# EAGLE board mmu6100 (EAGLE 6.6.0), part 1 of 2
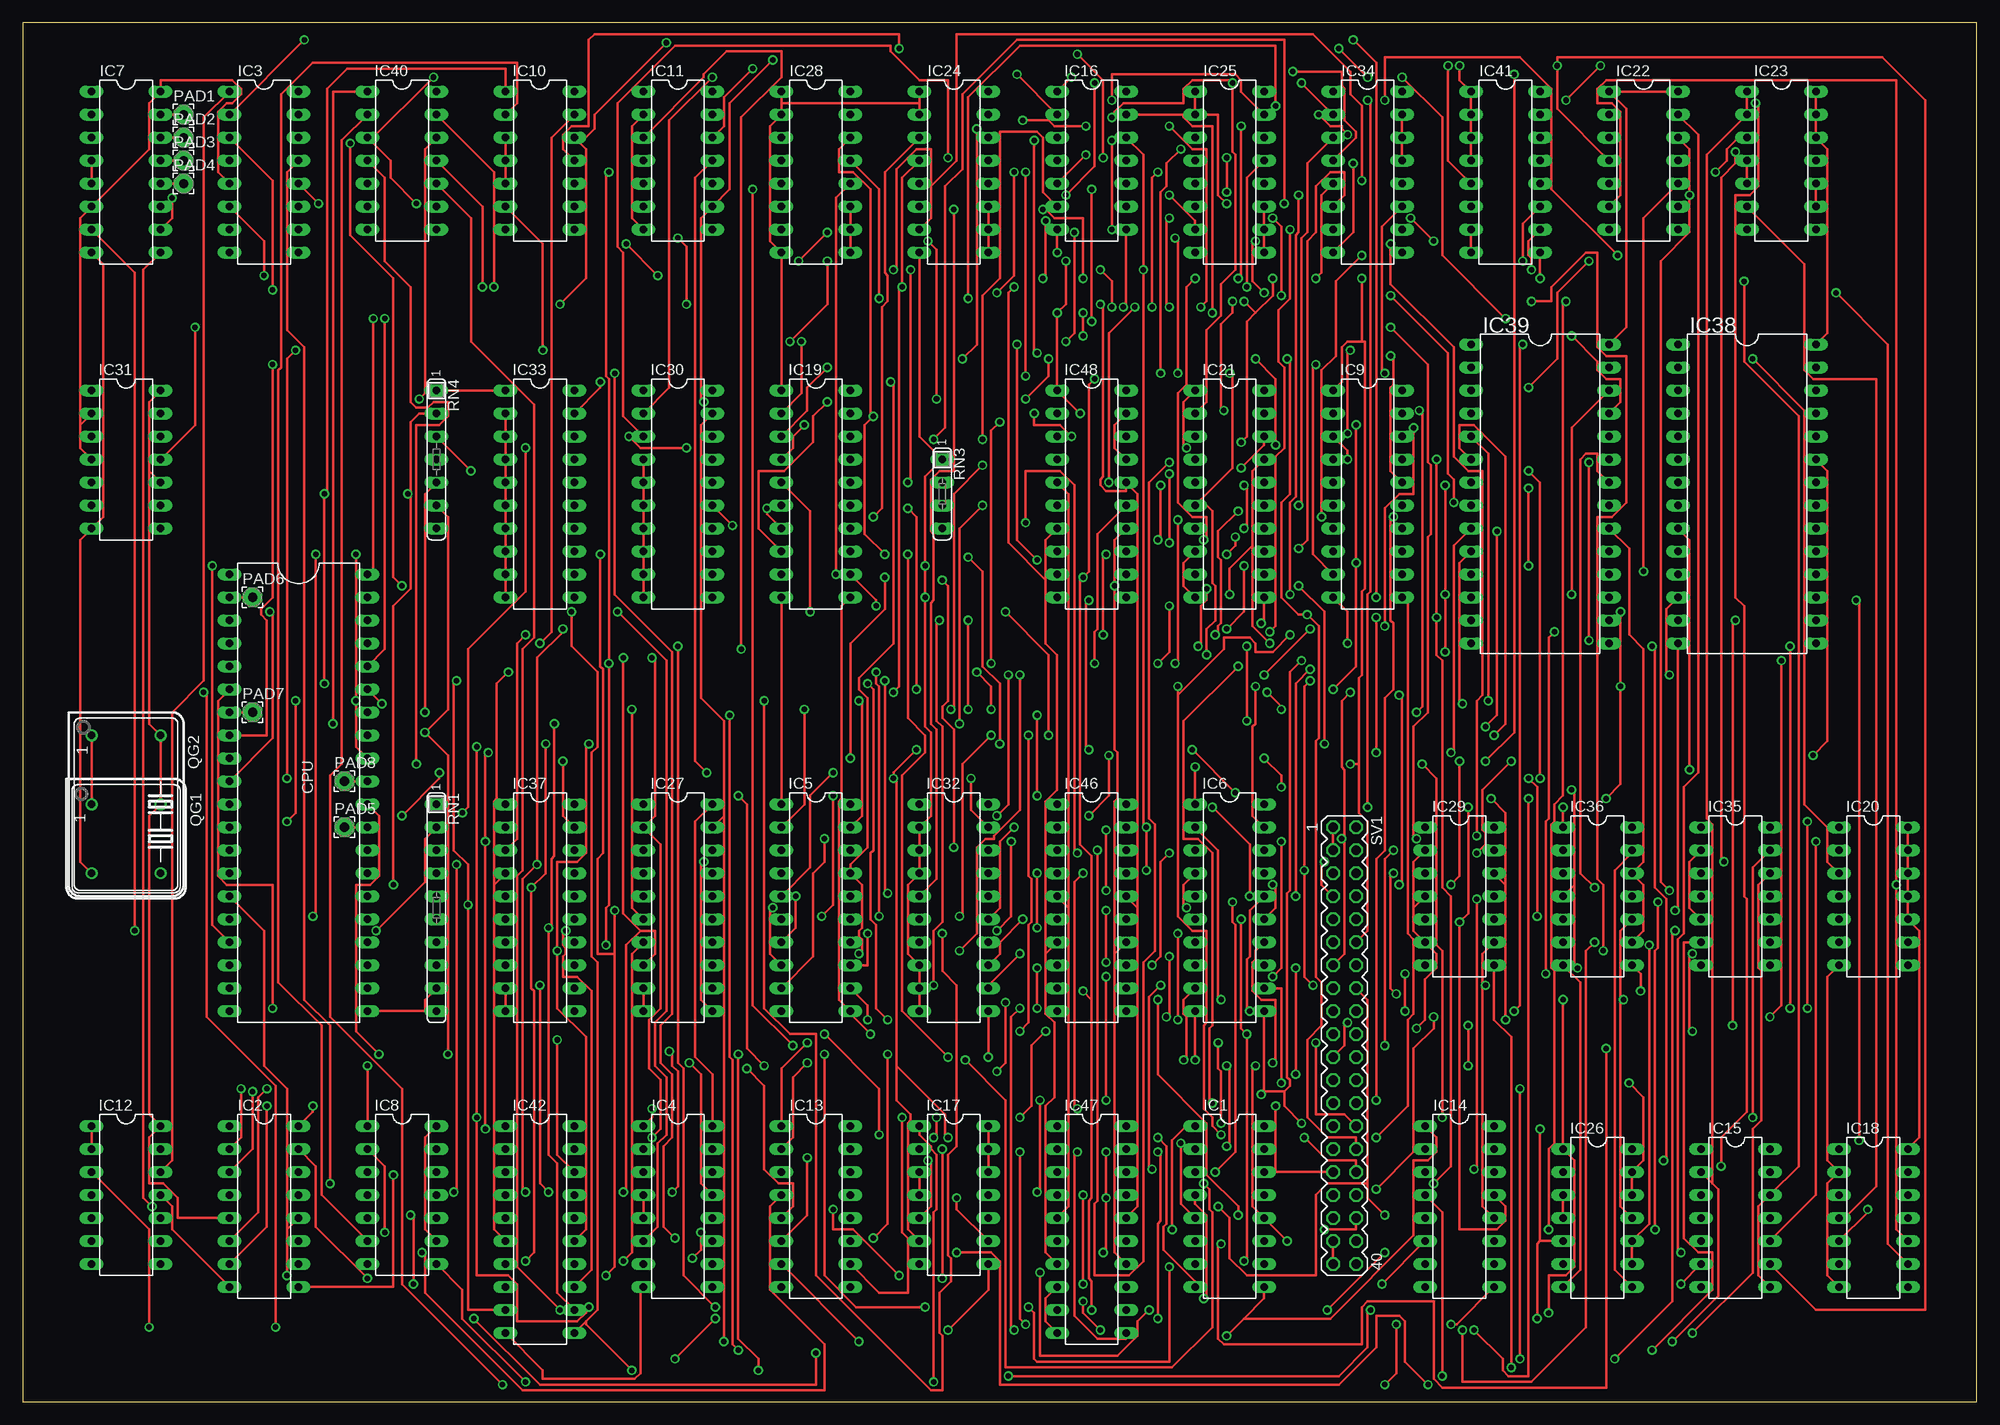
[diagram p3: board, top side]
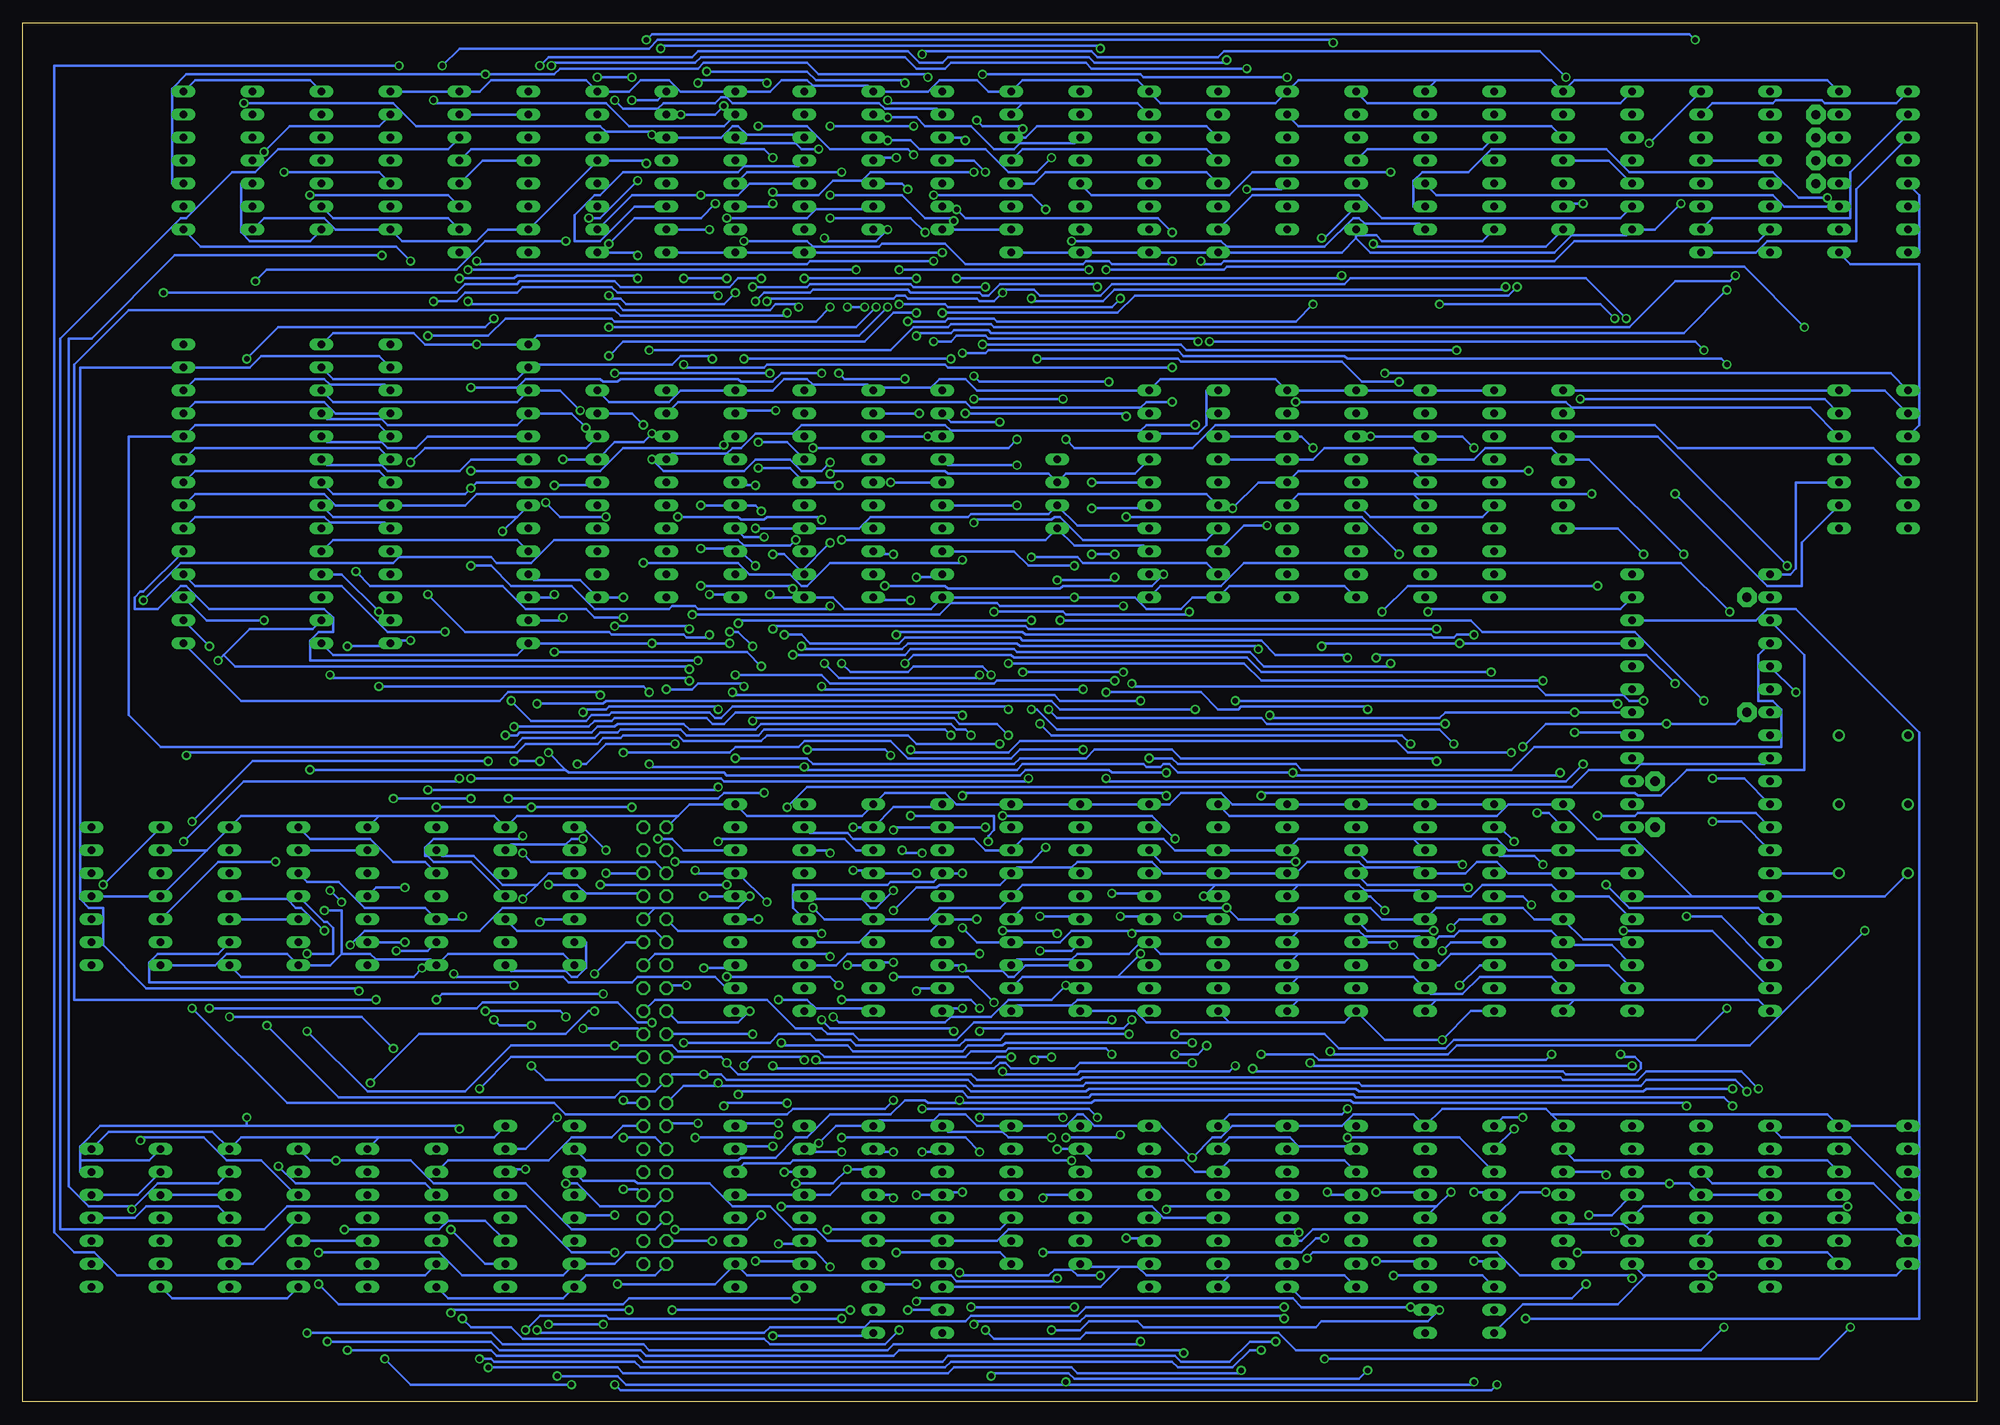
[diagram p4: board, bottom side, seen from below]

Size 215.9 x 152.4 mm. Coordinates in mm from the lower left corner, seen from the top.
Outline: 0,0 215.9,0 215.9,152.4 0,152.4 0,0
Copper layers (1*16): Top 0.035mm / dielectric 1.5mm / Bottom 0.035mm
Design rules "10mils *": minimum track width 10mil, minimum drill 24mil, track to track 10mil, track to pad 10mil, pad to pad 10mil, via to via 10mil, smd to smd 10mil, copper to edge 40mil, drill to drill 10mil, minimum pad ring 10mil, minimum via ring 8mil, stop-mask expansion 0mil, vias tented up to drill 0mil, thermal gap 10mil

## Footprints (pad centres in the part's own frame; a part is rotated, then mirrored left to right if it is on the bottom)
DIL40 = drill 0.813 long: 1 -24.13,-7.62; 2 -21.59,-7.62; 3 -19.05,-7.62; 4 -16.51,-7.62; 5 -13.97,-7.62; 6 -11.43,-7.62; 7 -8.89,-7.62; 8 -6.35,-7.62; 9 -3.81,-7.62; 10 -1.27,-7.62; 11 1.27,-7.62; 12 3.81,-7.62; 13 6.35,-7.62; 14 8.89,-7.62; 15 11.43,-7.62; 16 13.97,-7.62; 17 16.51,-7.62; 18 19.05,-7.62; 19 21.59,-7.62; 20 24.13,-7.62; 21 24.13,7.62; 22 21.59,7.62; 23 19.05,7.62; 24 16.51,7.62; 25 13.97,7.62; 26 11.43,7.62; 27 8.89,7.62; 28 6.35,7.62; 29 3.81,7.62; 30 1.27,7.62; 31 -1.27,7.62; 32 -3.81,7.62; 33 -6.35,7.62; 34 -8.89,7.62; 35 -11.43,7.62; 36 -13.97,7.62; 37 -16.51,7.62; 38 -19.05,7.62; 39 -21.59,7.62; 40 -24.13,7.62
DIL16 = drill 0.813 long: 1 -8.89,-3.81; 2 -6.35,-3.81; 3 -3.81,-3.81; 4 -1.27,-3.81; 5 1.27,-3.81; 6 3.81,-3.81; 7 6.35,-3.81; 8 8.89,-3.81; 9 8.89,3.81; 10 6.35,3.81; 11 3.81,3.81; 12 1.27,3.81; 13 -1.27,3.81; 14 -3.81,3.81; 15 -6.35,3.81; 16 -8.89,3.81
DIL20 = drill 0.813 long: 1 -11.43,-3.81; 2 -8.89,-3.81; 3 -6.35,-3.81; 4 -3.81,-3.81; 5 -1.27,-3.81; 6 1.27,-3.81; 7 3.81,-3.81; 8 6.35,-3.81; 9 8.89,-3.81; 10 11.43,-3.81; 11 11.43,3.81; 12 8.89,3.81; 13 6.35,3.81; 14 3.81,3.81; 15 1.27,3.81; 16 -1.27,3.81; 17 -3.81,3.81; 18 -6.35,3.81; 19 -8.89,3.81; 20 -11.43,3.81
DIL14 = drill 0.813 long: 1 -7.62,-3.81; 2 -5.08,-3.81; 3 -2.54,-3.81; 4 0,-3.81; 5 2.54,-3.81; 6 5.08,-3.81; 7 7.62,-3.81; 8 7.62,3.81; 9 5.08,3.81; 10 2.54,3.81; 11 0,3.81; 12 -2.54,3.81; 13 -5.08,3.81; 14 -7.62,3.81
DIL28-6 = drill 0.813 long: 1 -16.51,-7.62; 2 -13.97,-7.62; 3 -11.43,-7.62; 4 -8.89,-7.62; 5 -6.35,-7.62; 6 -3.81,-7.62; 7 -1.27,-7.62; 8 1.27,-7.62; 9 3.81,-7.62; 10 6.35,-7.62; 11 8.89,-7.62; 12 11.43,-7.62; 13 13.97,-7.62; 14 16.51,-7.62; 15 16.51,7.62; 16 13.97,7.62; 17 11.43,7.62; 18 8.89,7.62; 19 6.35,7.62; 20 3.81,7.62; 21 1.27,7.62; 22 -1.27,7.62; 23 -3.81,7.62; 24 -6.35,7.62; 25 -8.89,7.62; 26 -11.43,7.62; 27 -13.97,7.62; 28 -16.51,7.62
2,15/1,0 = drill 1.016 pad 2.159 octagon: 1 0,0
DIL08S = drill 0.813: 1 -3.81,-3.81; 4 3.81,-3.81; 5 3.81,3.81; 8 -3.81,3.81
DIL14S = drill 0.813: 1 -7.62,-3.81; 7 7.62,-3.81; 8 7.62,3.81; 14 -7.62,3.81
SIL10 = drill 0.813 long: 1 -11.43,0; 2 -8.89,0; 3 -6.35,0; 4 -3.81,0; 5 -1.27,0; 6 1.27,0; 7 3.81,0; 8 6.35,0; 9 8.89,0; 10 11.43,0
SIL4 = drill 0.813 long: 1 -3.81,0; 2 -1.27,0; 3 1.27,0; 4 3.81,0
SIL7 = drill 0.813 long: 1 -7.62,0; 2 -5.08,0; 3 -2.54,0; 4 0,0; 5 2.54,0; 6 5.08,0; 7 7.62,0
MA20-2 = drill 1.016 octagon: 1 -24.13,-1.27; 2 -24.13,1.27; 3 -21.59,-1.27; 4 -21.59,1.27; 5 -19.05,-1.27; 6 -19.05,1.27; 7 -16.51,-1.27; 8 -16.51,1.27; 9 -13.97,-1.27; 10 -13.97,1.27; 11 -11.43,-1.27; 12 -11.43,1.27; 13 -8.89,-1.27; 14 -8.89,1.27; 15 -6.35,-1.27; 16 -6.35,1.27; 17 -3.81,-1.27; 18 -3.81,1.27; 19 -1.27,-1.27; 20 -1.27,1.27; 21 1.27,-1.27; 22 1.27,1.27; 23 3.81,-1.27; 24 3.81,1.27; 25 6.35,-1.27; 26 6.35,1.27; 27 8.89,-1.27; 28 8.89,1.27; 29 11.43,-1.27; 30 11.43,1.27; 31 13.97,-1.27; 32 13.97,1.27; 33 16.51,-1.27; 34 16.51,1.27; 35 19.05,-1.27; 36 19.05,1.27; 37 21.59,-1.27; 38 21.59,1.27; 39 24.13,-1.27; 40 24.13,1.27

## Placement (x,y rotation side)
CPU  IM6100  [DIL40]  30.48,67.31 270 top
IC1  74LS75N  [DIL16]  133.35,21.59 270 top
IC2  74LS75N  [DIL16]  26.67,21.59 270 top
IC3  74LS75N  [DIL16]  26.67,135.89 270 top
IC4  74LS138N  [DIL16]  72.39,21.59 270 top
IC5  74LS373N  [DIL20]  87.63,54.61 270 top
IC6  74LS245N  [DIL20]  133.35,54.61 270 top
IC7  74LS138N  [DIL16]  11.43,135.89 270 top
IC8  74LS20N  [DIL14]  41.91,22.86 270 top
IC9  74LS245N  [DIL20]  148.59,100.33 270 top
IC10  74LS00N  [DIL14]  57.15,137.16 270 top
IC11  74LS74N  [DIL14]  72.39,137.16 270 top
IC12  74LS30N  [DIL14]  11.43,22.86 270 top
IC13  74LS138N  [DIL16]  87.63,21.59 270 top
IC14  74LS138N  [DIL16]  158.75,21.59 270 top
IC15  74LS08N  [DIL14]  189.23,20.32 270 top
IC16  74LS32N  [DIL14]  118.11,137.16 270 top
IC17  74LS32N  [DIL14]  102.87,22.86 270 top
IC18  74LS74N  [DIL14]  204.47,20.32 270 top
IC19  74LS373N  [DIL20]  87.63,100.33 270 top
IC20  74LS74N  [DIL14]  204.47,55.88 270 top
IC21  74LS241N  [DIL20]  133.35,100.33 270 top
IC22  74LS20N  [DIL14]  179.07,137.16 270 top
IC23  74LS00N  [DIL14]  194.31,137.16 270 top
IC24  74LS173N  [DIL16]  102.87,135.89 270 top
IC25  74LS173N  [DIL16]  133.35,135.89 270 top
IC26  74LS00N  [DIL14]  173.99,20.32 270 top
IC27  74LS245N  [DIL20]  72.39,54.61 270 top
IC28  74LS173N  [DIL16]  87.63,135.89 270 top
IC29  74LS07N  [DIL14]  158.75,55.88 270 top
IC30  74LS245N  [DIL20]  72.39,100.33 270 top
IC31  74LS74N  [DIL14]  11.43,104.14 270 top
IC32  74LS245N  [DIL20]  102.87,54.61 270 top
IC33  74LS245N  [DIL20]  57.15,100.33 270 top
IC34  74LS157N  [DIL16]  148.59,135.89 270 top
IC35  74LS32N  [DIL14]  189.23,55.88 270 top
IC36  74LS08N  [DIL14]  173.99,55.88 270 top
IC37  74LS245N  [DIL20]  57.15,54.61 270 top
IC38  62256P  [DIL28-6]  190.5,100.33 270 top
IC39  62256P  [DIL28-6]  167.64,100.33 270 top
IC40  74LS11N  [DIL14]  41.91,137.16 270 top
IC41  74LS151N  [DIL16]  163.83,135.89 270 top
IC42  74273N  [DIL20]  57.15,19.05 270 top
IC46  74LS244N  [DIL20]  118.11,54.61 270 top
IC47  74LS244N  [DIL20]  118.11,19.05 270 top
IC48  74LS244N  [DIL20]  118.11,100.33 270 top
PAD1  [2,15/1,0]  17.78,142.24 0 top
PAD2  [2,15/1,0]  17.78,139.7 0 top
PAD3  [2,15/1,0]  17.78,137.16 0 top
PAD4  [2,15/1,0]  17.78,134.62 0 top
PAD5  [2,15/1,0]  35.56,63.5 0 top
PAD6  [2,15/1,0]  25.4,88.9 0 top
PAD7  [2,15/1,0]  25.4,76.2 0 top
PAD8  [2,15/1,0]  35.56,68.58 0 top
QG1  [DIL08S]  11.43,62.23 270 top
QG2  [DIL14S]  11.43,66.04 270 top
RN1  100K  [SIL10]  45.72,54.61 270 top
RN3  100K  [SIL4]  101.6,100.33 270 top
RN4  [SIL7]  45.72,104.14 270 top
SV1  [MA20-2]  146.05,39.37 270 top

## Tracks (layer width: path | path; a pad name or v marks a point on that pad's centre or on a via)
!00  (via drill 0.61)
  Top 0.254: v44.13,16.51 44.45,16.19 44.45,12.06 55.24,1.27 88.58,1.27 88.58,6.35 82.55,12.38 82.55,21.59 IC13.4
  Bottom 0.254: IC12.8 16.51,16.51 v44.13,16.51
!2X  (via drill 0.61)
  Top 0.254: IC8.8 48.58,12.38 48.58,9.21 v55.56,2.22 | v100.65,2.22 100.65,20.95 100.97,21.27 100.97,27.3 100.33,27.94 100.33,28.26 99.06,29.53 IC17.1 | IC14.4 156.84,20.95 v156.84,2.86
  Bottom 0.254: v55.56,2.22 55.88,1.91 100.33,1.91 | v156.84,2.86 150.18,2.86 149.22,1.91 100.33,1.91 | 100.33,1.91 v100.65,2.22
!AND
  Top 0.254: PAD1.1 IC7.15
!C0  (via drill 0.61)
  Top 0.254: CPU.32 36.83,72.39 v36.83,77.47 v36.83,93.66 | v95.57,42.23 94.3,43.5 94.3,52.7 93.66,53.34 93.66,60.64 93.98,60.96 93.98,78.74 v93.34,79.38
  Bottom 0.254: v36.83,93.66 39.69,96.52 RN4.7 | SV1.18 146.05,44.45 133.67,44.45 130.49,41.27 127.64,41.27 127,40.64 124.14,40.64 123.51,40.01 112.71,40.01 110.81,41.91 95.89,41.91 v95.57,42.23 | v93.34,79.38 93.03,79.06 48.58,79.06 47.62,78.11 39.05,78.11 38.42,77.47 v36.83,77.47
!C1  (via drill 0.61)
  Top 0.254: RN4.6 46.99,97.79 46.99,76.52 v44.45,73.98 46.99,71.44 v46.99,38.42 | 153.67,54.61 153.67,52.07 IC29.6 156.21,49.53 156.21,47.94 154.94,46.67 154.94,42.23 v153.99,41.27 | IC29.4 153.67,54.61 | IC29.2 153.67,59.69 153.67,54.61 | v79.06,38.42 79.06,6.99 81.28,4.76 v81.28,3.49 | v164.47,3.81 164.47,40.32 162.56,42.23 IC29.8
  Bottom 0.254: CPU.33 38.42,73.98 v44.45,73.98 | IC29.8 161.93,47.62 155.89,47.62 155.26,46.99 154.62,46.99 153.67,47.94 153.67,50.8 IC29.6 | SV1.20 147.96,41.27 v153.99,41.27 | v46.99,38.42 47.62,37.78 72.71,37.78 73.34,38.42 v79.06,38.42 | v81.28,3.49 81.6,3.17 99.38,3.17 100.01,3.81 113.03,3.81 113.67,3.17 149.54,3.17 150.18,3.81 v164.47,3.81
!C2  (via drill 0.61)
  Top 0.254: v44.45,76.2 44.45,100.33 RN4.5 | v165.42,4.76 v165.42,34.61 | v79.06,5.71 78.42,6.35 78.42,37.78 78.11,38.1 v78.11,75.88
  Bottom 0.254: CPU.34 v44.45,76.2 58.74,76.2 59.37,75.56 77.79,75.56 v78.11,75.88 | SV1.22 161.93,38.1 v165.42,34.61 | v165.42,4.76 164.15,4.76 163.83,4.45 148.27,4.45 147.64,3.81 113.98,3.81 113.35,4.45 88.9,4.45 88.27,3.81 82.23,3.81 80.33,5.71 v79.06,5.71
!CAF  (via drill 0.61)
  Top 0.254: v92.39,6.67 IC13.7 | v184.47,7.62 191.13,14.29 191.13,30.16 192.09,31.11 192.09,47.62 191.77,47.94 191.77,57.15 IC35.12
  Bottom 0.254: v92.39,6.67 92.71,6.35 119.7,6.35 120.33,5.71 146.69,5.71 147.32,6.35 162.88,6.35 164.15,7.62 v184.47,7.62
!CDF  (via drill 0.61)
  Top 0.254: v119.38,16.51 119.7,16.83 v119.7,22.54 v119.7,27.62 | IC40.10 49.53,130.81 49.53,117.16 56.52,110.17 56.52,84.45 55.24,83.19 55.24,58.74 54.61,58.1 54.61,14.92 v59.37,10.16 | v102.23,7.94 106.68,12.38 IC17.8
  Bottom 0.254: IC17.8 107.95,16.51 v119.38,16.51 | v119.7,22.54 120.02,22.86 IC47.17 | IC47.19 121.6,27.62 v119.7,27.62 | v59.37,10.16 60.64,8.89 72.39,8.89 73.03,8.26 92.08,8.26 92.71,8.89 98.11,8.89 99.06,7.94 v102.23,7.94
!CIF  (via drill 0.61)
  Top 0.254: IC40.4 40.01,135.25 40.01,126.05 42.86,123.19 42.86,110.49 43.5,109.86 44.77,109.86 45.4,110.49 46.99,110.49 46.99,108.9 46.04,107.95 43.5,107.95 v43.5,70.48 | 96.52,37.15 96.52,33.34 98.11,31.75 98.11,31.11 97.79,30.8 97.79,19.05 IC17.6 | 96.52,37.15 96.52,68.58 v96.2,68.9 96.2,69.53 v98.74,72.07 | v102.23,29.21 101.92,29.53 101.92,31.75 96.52,37.15 | IC22.10 179.07,130.81 v179.07,91.76 | v149.54,71.75 v149.54,86.68
  Bottom 0.254: v43.5,70.48 45.4,68.58 95.89,68.58 v96.2,68.9 | IC47.1 113.67,29.84 107.63,29.84 107,29.21 v102.23,29.21 | v179.07,91.76 177.48,90.17 162.88,90.17 160.34,87.63 153.67,87.63 152.72,86.68 v149.54,86.68 | v149.54,71.75 137.79,71.75 137.16,72.39 130.18,72.39 129.54,73.03 120.02,73.03 118.11,71.12 106.68,71.12 105.73,72.07 v98.74,72.07
!CINT  (via drill 0.61)
  Top 0.254: IC11.3 75.25,146.37 75.25,146.69 77.79,149.22 83.82,149.22 83.82,146.37 79.38,141.92 v79.38,83.19 | v129.86,83.5 130.18,83.82 130.18,87.95 130.81,88.58 v130.81,89.85 | v140.97,90.17 143.83,87.31 v143.83,72.71 | v154.62,70.48 156.21,68.9 156.21,50.48 156.84,49.85 v156.84,31.43
  Bottom 0.254: v79.38,83.19 79.69,83.5 105.73,83.5 106.05,83.82 118.11,83.82 118.75,83.19 129.54,83.19 v129.86,83.5 | v130.81,89.85 131.13,90.17 v140.97,90.17 | v143.83,72.71 151.45,72.71 153.67,70.48 v154.62,70.48 | v156.84,31.43 160.34,27.94 IC14.15
!CPREQ  (via drill 0.61)
  Top 0.254: v20,78.42 20.32,78.11 20.32,42.55 27.94,34.92 v27.94,8.26 | v109.54,7.94 109.22,8.26 109.22,42.55 v110.17,43.5 | v125.41,44.45 125.41,36.2 130.81,30.8 130.81,25.08 134.3,21.59 v134.3,20.64 | v143.83,19.05 147.32,19.05 SV1.36
  Bottom 0.254: v20,78.42 CPU.5 | v27.94,8.26 30.48,5.71 75.25,5.71 77.15,7.62 98.42,7.62 99.06,6.99 108.58,6.99 v109.54,7.94 | v110.17,43.5 111.12,44.45 v125.41,44.45 | v134.3,20.64 135.89,19.05 v143.83,19.05
!CPSEL  (via drill 0.61)
  Top 0.254: IC23.1 IC23.2 186.06,137.79 186.06,64.45 186.69,63.82 186.69,24.13 | v49.85,9.21 57.15,1.91 87.63,1.91 v87.63,5.4 | v182.25,6.67 187.32,11.75 187.32,23.5 186.69,24.13 | IC15.2 186.69,24.13
  Bottom 0.254: CPU.38 24.45,86.36 23.18,87.63 20,87.63 6.35,73.98 6.35,9.21 v49.85,9.21 | v87.63,5.4 87.95,5.71 119.06,5.71 119.7,5.08 147,5.08 147.64,5.71 163.19,5.71 164.15,6.67 v182.25,6.67
!CPUINTREQ  (via drill 0.61)
  Top 0.254: CPU.8 26.99,73.66 26.99,86.36 26.35,87 26.35,87.63 27.62,88.9 v27.62,114.62 | v112.08,115.89 111.76,116.2 v111.76,139.38
  Bottom 0.254: v27.62,114.62 28.26,115.25 69.53,115.25 69.85,115.57 87.63,115.57 88.27,116.2 109.22,116.2 109.54,115.89 v112.08,115.89 | v111.76,139.38 112.08,139.7 IC16.3
!CUF  (via drill 0.61)
  Top 0.254: IC40.2 35.24,139.38 35.24,70.48 33.97,69.22 33.97,42.55 41.91,34.61 41.91,13.02 v53.02,1.91 | v150.5,1.91 151.76,3.17 v151.76,8.57 | v157.8,8.57 158.43,8.57 IC14.9
  Bottom 0.254: v53.02,1.91 53.66,1.27 149.86,1.27 v150.5,1.91 | v157.8,8.57 v151.76,8.57
!DCA
  Top 0.254: PAD4.1 IC7.12
!DEVINTREQ  (via drill 0.61)
  Top 0.254: IC23.10 IC23.9 | v115.89,146.37 IC16.1 | v157.8,57.15 158.75,58.1 v158.75,70.8 | v161.61,70.8 164.78,73.98 v164.78,146.69
  Bottom 0.254: v115.89,146.37 116.2,146.69 127.95,146.69 129.22,147.96 140.65,147.96 141.29,147.32 156.53,147.32 157.16,146.69 v164.78,146.69 197.8,146.69 199.39,145.1 199.39,134.62 IC23.10 | SV1.8 147.64,56.2 153.67,56.2 154.62,57.15 v157.8,57.15 | v161.61,70.8 v158.75,70.8
!DEVSEL  (via drill 0.61)
  Top 0.254: v132.08,21.59 133.35,20.32 133.35,15.88 135.25,13.97 142.88,13.97 142.88,22.86 144.15,24.13 148.59,24.13 | 148.59,24.13 148.59,44.45 SV1.16 | v150.5,20.64 148.59,22.54 148.59,24.13 | CPU.30 39.37,64.77 39.37,58.1 38.42,57.15 36.83,57.15 36.83,40.96 v39.37,38.42 | v80.01,36.83 81.92,34.92 81.92,25.72 83.5,24.13 85.09,24.13 85.09,21.59 IC13.5
  Bottom 0.254: IC13.5 89.85,20.32 91.12,21.59 v132.08,21.59 | IC14.5 154.62,20.64 v150.5,20.64 | v39.37,38.42 39.05,38.1 37.78,38.1 37.15,37.47 37.15,36.83 37.78,36.2 45.4,36.2 45.72,36.51 79.69,36.51 v80.01,36.83
!DMAREQ  (via drill 0.61)
  Top 0.254: v91.44,71.12 91.44,83.82 95.25,87.63 v95.25,91.12 | v101.6,90.81 102.23,90.17 102.23,77.47 101.6,76.83 101.6,75.56 102.87,74.3 v102.87,61.28 | v143.83,59.69 143.51,59.37 143.51,57.15 SV1.7
  Bottom 0.254: CPU.4 24.13,82.55 24.13,77.47 22.54,77.47 21.59,76.52 21.59,72.39 48.9,72.39 51.44,69.85 74.61,69.85 75.25,70.48 88.27,70.48 88.9,71.12 v91.44,71.12 | v95.25,91.12 95.57,90.81 v101.6,90.81 | v102.87,61.28 104.46,59.69 v143.83,59.69
!DORTF  (via drill 0.61)
  Top 0.254: v43.5,132.4 40.64,135.25 40.64,137.16 38.42,139.38 | v119.38,137.48 119.38,146.05 v116.52,148.91 | 38.42,139.38 v45.4,146.37 | 38.42,139.38 IC40.3
  Bottom 0.254: IC40.9 45.4,132.4 v43.5,132.4 | IC16.11 121.6,137.48 v119.38,137.48 | v116.52,148.91 116.2,149.22 97.79,149.22 97.16,148.59 83.82,148.59 83.19,149.22 48.26,149.22 v45.4,146.37
!ERROR
  Top 0.254: IC10.5 IC10.4 IC10.3
  Bottom 0.254: IC11.4 67.31,138.43 54.61,138.43 IC10.3
!GTF  (via drill 0.61)
  Top 0.254: v93.98,18.1 95.57,19.68 v95.57,38.42 | v150.5,39.37 150.5,60.01 v151.45,60.96 | v184.47,49.53 184.15,49.21 184.15,41.27 v184.47,40.96
  Bottom 0.254: IC13.11 91.76,18.1 v93.98,18.1 | v95.57,38.42 96.2,39.05 107,39.05 107.31,38.73 111.12,38.73 111.76,38.1 127.32,38.1 127.95,38.73 143.51,38.73 144.15,39.37 v150.5,39.37 161.93,39.37 167,34.29 177.8,34.29 v184.47,40.96 | v151.45,60.96 153.99,63.5 IC29.1 | IC35.4 182.56,53.02 182.25,53.02 181.61,52.39 181.61,49.53 v184.47,49.53
!HLT  (via drill 0.61)
  Top 0.254: v38.1,37.15 IC8.1 | v73.66,37.47 74.93,36.2 74.93,24.13 IC4.13
  Bottom 0.254: v38.1,37.15 73.34,37.15 v73.66,37.47
!INTCLR  (via drill 0.61)
  Top 0.254: IC26.3 IC26.4 | IC40.13 52.07,135.89 v52.07,123.19 | v104.46,121.92 104.46,144.15 110.17,149.86 138.43,149.86 v138.43,143.19 | v143.19,142.24 144.46,140.97 145.73,140.97 145.73,140.65 v146.37,140.02 | v191.45,143.51 191.77,143.19 191.77,134.3 190.82,133.35 189.23,133.35 189.23,88.9 190.18,87.95 190.18,55.88 190.5,55.56 190.5,32.07 187.64,29.21 v187.64,26.04
  Bottom 0.254: v52.07,123.19 52.39,122.87 95.25,122.87 96.52,121.6 104.14,121.6 v104.46,121.92 | v138.43,143.19 139.38,142.24 v143.19,142.24 | v146.37,140.02 146.69,140.34 151.45,140.34 152.08,140.97 172.4,140.97 174.94,143.51 v191.45,143.51 | v187.64,26.04 185.74,24.13 171.45,24.13 IC26.3
!IO_RESET
  Bottom 0.254: IC29.10 161.29,52.07 146.05,52.07 SV1.11
!IOT  (via drill 0.61)
  Top 0.254: v14.29,21.59 13.34,22.54 13.34,125.09 IC7.9
  Bottom 0.254: IC8.5 36.83,21.59 v14.29,21.59 | IC31.3 6.35,107.95 6.35,125.73 13.97,125.73 IC7.9
!IR3
  Top 0.254: IC3.1 20,141.92 20,79.69 16.51,76.2 16.51,26.67 IC12.12
  Bottom 0.254: IC12.12 16.51,26.67 44.45,26.67 IC8.13
!IR4
  Top 0.254: IC2.8 16.51,19.05 16.51,21.59 IC12.11
!IR5
  Bottom 0.254: IC12.6 8.89,19.05 29.21,19.05 | IC2.11 29.21,19.05 | IC8.10 45.09,19.68 39.05,19.68 38.42,19.05 29.21,19.05
!IR6
  Bottom 0.254: IC12.5 11.43,24.13 29.21,24.13 IC2.14
!IR7
  Bottom 0.254: IC12.4 13.97,29.21 21.59,29.21 IC2.1
!IR8  (via drill 0.61)
  Top 0.254: IC12.3 13.97,19.05 v13.97,8.26 | v76.52,9.21 v72.07,4.76 | v110.81,8.57 110.17,9.21 v110.17,27.62 | v125.41,29.21 126.36,28.26 126.36,19.68 126.05,19.37 126.05,16.83 129.54,13.34 IC1.8
  Bottom 0.254: v13.97,8.26 17.46,4.76 v72.07,4.76 | v76.52,9.21 76.83,9.53 98.42,9.53 99.06,8.89 110.49,8.89 v110.81,8.57 | v110.17,27.62 111.76,29.21 v125.41,29.21
!IR10  (via drill 0.61)
  Top 0.254: IC17.5 100.33,21.59 100.33,26.35 v100.01,26.67
  Bottom 0.254: v100.01,26.67 130.81,26.67 131.13,26.35 136.21,26.35 IC1.14
!IR11  (via drill 0.61)
  Top 0.254: v127,19.05 127,28.89 128.59,30.48 IC1.1
  Bottom 0.254: IC17.10 107.95,19.05 v127,19.05
!ISZ
  Top 0.254: PAD3.1 IC7.13
!JMP  (via drill 0.61)
  Top 0.254: IC7.10 16.51,130.81 v16.51,133.03
  Bottom 0.254: v16.51,133.03 19.68,133.03 22.54,135.89 38.42,135.89 40.96,138.43 53.66,138.43 56.2,135.89 61.28,135.89 62.23,134.94 62.23,132.08 IC10.9
!JMS
  Bottom 0.254: IC7.11 21.27,132.08 22.54,133.35 59.69,133.35 IC10.10
!MEMSEL  (via drill 0.61)
  Top 0.254: IC36.9 179.07,52.07 179.07,57.15 IC36.12 179.07,59.69 179.07,83.19 177.48,84.77 177.48,94.3 IC39.20 | v57.15,83.82 58.42,85.09 58.42,139.7 IC10.13 | v173.67,50.8 172.72,49.85 172.72,8.26 166.69,2.22 159.07,2.22 v159.07,7.94 | v76.52,10.48 73.03,13.97 73.03,36.83 72.39,37.47 v72.39,83.5
  Bottom 0.254: IC39.20 175.9,97.16 181.93,97.16 182.56,97.79 196.85,97.79 IC38.20 | CPU.37 v57.15,83.82 72.07,83.82 v72.39,83.5 | v173.67,50.8 IC36.9 | v159.07,7.94 158.75,7.62 133.99,7.62 133.35,8.26 122.87,8.26 122.24,8.89 111.76,8.89 111.12,9.53 99.38,9.53 98.42,10.48 v76.52,10.48
!OE  (via drill 0.61)
  Top 0.254: v173.67,56.83 172.09,58.42 172.09,104.14 172.72,104.78 173.99,104.78 173.99,102.87 IC39.22
  Bottom 0.254: IC36.11 176.85,56.83 v173.67,56.83 | IC38.22 196.85,102.87 176.53,102.87 IC39.22
!OPR  (via drill 0.61)
  Top 0.254: IC4.4 IC4.5 | IC7.7 12.38,124.78 v12.38,52.07 | v71.44,38.73 71.75,38.42 71.75,37.15 72.39,36.51 72.39,23.81 v71.75,23.18
  Bottom 0.254: v12.38,52.07 25.08,39.37 57.47,39.37 58.42,38.42 71.12,38.42 v71.44,38.73 | v71.75,23.18 71.44,22.86 IC4.4
!OSR  (via drill 0.61)
  Top 0.254: IC8.2 40.01,26.04 v40.01,18.73
  Bottom 0.254: v40.01,18.73 40.32,19.05 73.34,19.05 74.61,17.78 IC4.11
!OSRHLT  (via drill 0.61)
  Top 0.254: v42.86,20.64 43.18,20.32 v43.18,13.02
  Bottom 0.254: IC8.4 40.32,20.64 v42.86,20.64 | v43.18,13.02 44.77,11.43 74.61,11.43 75.88,12.7 IC4.9
!RDF  (via drill 0.61)
  Top 0.254: v160.34,25.72 160.66,26.04 v160.66,55.56
  Bottom 0.254: IC14.14 162.24,25.72 v160.34,25.72 | 159.07,57.15 157.8,58.42 IC29.3 | 159.07,57.15 v160.66,55.56 | IC36.2 169.54,60.33 166.05,60.33 162.88,57.15 159.07,57.15
!RESET  (via drill 0.61)
  Top 0.254: 167.64,17.78 IC26.5 | v167.64,30.16 167.64,17.78 | IC35.13 191.13,59.05 v191.13,31.43 | v50.16,72.39 v50.16,31.43 50.16,13.97 53.66,13.97 54.61,13.02 54.61,8.89 61.28,8.89 62.23,9.84 62.23,10.16 v62.55,10.48 | PAD7.1 CPU.7 | IC40.1 34.29,144.78 v34.29,74.93 | 167.64,17.78 167.32,17.46 v167.32,9.21 | v119.06,7.94 117.16,9.84 v117.16,11.11
  Bottom 0.254: v167.64,30.16 167.96,30.48 191.13,30.48 | 191.13,30.48 207.33,30.48 209.55,28.26 209.55,26.67 | 209.55,26.67 209.55,25.4 IC18.13 | 191.13,30.48 v191.13,31.43 | IC18.1 201.93,26.67 209.55,26.67 | IC40.1 39.37,143.51 67.31,143.51 IC11.1 | IC42.1 52.39,31.43 v50.16,31.43 | v50.16,72.39 47.62,74.93 v34.29,74.93 26.67,74.93 PAD7.1 | v167.32,9.21 166.37,8.26 161.93,8.26 160.66,6.99 133.99,6.99 133.35,6.35 120.65,6.35 v119.06,7.94 | v117.16,11.11 116.84,11.43 75.56,11.43 74.61,10.48 v62.55,10.48
!RIB  (via drill 0.61)
  Top 0.254: IC14.12 161.29,21.59 161.29,46.04 | 161.29,46.04 161.29,49.53 IC29.9 | 161.29,46.04 v161.61,46.04
  Bottom 0.254: IC35.9 194.31,49.53 200.98,49.53 201.93,48.58 201.93,46.35 161.93,46.35 v161.61,46.04
!RIF  (via drill 0.61)
  Top 0.254: IC14.13 163.83,21.59 163.83,20 162.88,19.05 158.75,19.05 v158.75,53.02 159.7,53.98 v159.7,65.72 | v148.59,143.83 148.91,143.51 148.91,89.53 148.59,89.22 v148.59,65.72 | IC36.1 v170.18,65.72
  Bottom 0.254: v158.75,53.02 158.43,53.34 IC29.5 | IC34.1 145.73,143.83 v148.59,143.83 | v170.18,65.72 v159.7,65.72 v148.59,65.72
!RMF  (via drill 0.61)
  Top 0.254: IC48.17 120.65,105.41 120.65,107.95 IC48.19 | v116.84,109.22 IC48.1 v114.3,120.33 115.25,121.28 v115.25,126.05 | IC40.11 50.8,132.08 v50.8,123.19 | v180.34,19.05 180.34,49.85 180.66,50.16 v180.66,55.24 | v181.93,56.52 180.97,57.47 180.97,126.05 184.15,129.22 v184.15,133.35 184.15,138.43 IC22.12 | v165.74,126.05 165.74,130.18 IC41.11
  Bottom 0.254: IC40.5 40.64,137.16 IC40.11 | IC48.19 v116.84,109.22 | v50.8,123.19 51.75,122.24 93.03,122.24 94.93,120.33 v114.3,120.33 | IC14.11 164.78,20 168.91,20 169.86,19.05 v180.34,19.05 | v181.93,56.52 v180.66,55.24 | IC41.11 168.91,133.35 v184.15,133.35 | v115.25,126.05 128.91,126.05 129.22,125.73 165.42,125.73 v165.74,126.05
!RTF  (via drill 0.61)
  Top 0.254: IC13.10 94.61,12.06 97.79,12.06 97.79,18.1 97.16,18.73 v97.16,31.43 | v116.52,32.38 116.2,32.7 116.2,57.47 v117.16,58.42 | IC16.12 123.83,137.79 v123.83,125.09 123.83,63.82 v124.14,63.5 v124.14,58.74 | IC41.10 166.37,128.27 166.37,126.68 166.69,126.36 v166.69,125.09
  Bottom 0.254: v97.16,31.43 98.11,32.38 v116.52,32.38 | v117.16,58.42 IC46.17 122.24,58.74 v124.14,58.74 | IC41.10 168.91,130.81 181.61,130.81 IC22.9 | IC46.1 114.62,65.72 119.7,65.72 IC46.19 v124.14,63.5 | v123.83,125.09 v166.69,125.09
!RUNHLT  (via drill 0.61)
  Top 0.254: CPU.6 21.59,77.47 21.59,58.1 22.54,57.15 27.62,57.15 v27.62,43.5 | v88.58,40.64 94.61,34.61 v94.61,29.53 | v100.65,29.21 100.97,29.53 v100.97,31.43 | v110.17,31.43 111.44,32.7 111.44,39.37 v113.03,40.96 | v127.64,51.75 v127.64,42.23
  Bottom 0.254: v27.62,43.5 31.11,40.01 57.78,40.01 58.74,39.05 70.48,39.05 72.07,40.64 v88.58,40.64 | v94.61,29.53 94.93,29.21 v100.65,29.21 | v100.97,31.43 101.28,31.75 109.86,31.75 v110.17,31.43 | v113.03,40.96 113.35,41.27 126.68,41.27 v127.64,42.23 | v127.64,51.75 127.95,52.07 143.51,52.07 SV1.9
!SETZF  (via drill 0.61)
  Top 0.254: IC18.10 207.01,19.05 v207.01,57.15 207.01,146.05 174.94,146.05 173.99,145.1 173.99,143.51 175.58,143.51 176.53,142.56 176.53,133.35 IC22.6
  Bottom 0.254: v207.01,57.15 IC20.1
!SINT  (via drill 0.61)
  Top 0.254: v138.11,130.81 139.06,129.86 v139.06,122.24 | v170.5,121.6 170.18,121.28 170.18,66.99 169.23,66.04 169.23,64.14 168.91,63.82 168.91,47.94 169.23,47.62 169.23,28.57 168.59,27.94 v168.59,19.05
  Bottom 0.254: IC16.9 122.24,131.76 128.27,131.76 129.22,130.81 v138.11,130.81 | v139.06,122.24 139.38,122.56 150.18,122.56 150.81,123.19 160.66,123.19 161.29,122.56 167,122.56 167.96,121.6 v170.5,121.6 | v168.59,19.05 164.78,15.24 IC14.10
!SKP  (via drill 0.61)
  Top 0.254: 163.83,57.15 IC29.12 | v163.83,42.23 163.83,57.15 | v159.7,37.15 v159.7,41.59 | v39.69,77.15 CPU.35 | v81.92,77.47 81.92,43.5 84.77,40.64 87.63,40.64 87.63,13.97 100.33,1.27 101.6,1.27 101.6,7.3 101.28,7.62 101.28,12.06 102.55,13.34 102.55,15.88 102.23,16.19 102.23,27.3 103.19,28.26 103.19,46.04 101.6,47.62 v101.6,51.75 | v107.63,52.07 109.22,53.66 v109.22,61.91 | v117.79,64.77 120.02,66.99 v120.02,71.44 | v133.99,67.31 v129.22,72.07 | v162.24,66.67 163.83,65.09 163.83,57.15
  Bottom 0.254: v163.83,42.23 163.19,41.59 v159.7,41.59 | v159.7,37.15 158.12,35.56 SV1.24 | v39.69,77.15 40.01,77.47 v81.92,77.47 | v101.6,51.75 101.92,52.07 v107.63,52.07 | v109.22,61.91 109.22,62.55 108.58,63.18 108.58,64.77 v117.79,64.77 | v120.02,71.44 120.65,72.07 v129.22,72.07 | v133.99,67.31 138.43,67.31 139.06,66.67 v162.24,66.67
!SUF  (via drill 0.61)
  Top 0.254: v183.2,16.51 182.88,16.83 182.88,51.12 183.51,51.75 183.51,67.94 185.1,69.53 185.1,140.02 IC22.13 | v80.64,133.99 80.64,43.81 v85.09,39.37 | v88.58,38.42 88.58,13.97 92.08,10.48 v99.69,10.48 | v111.12,10.48 111.76,9.84 111.76,4.76 112.08,4.45 126.68,4.45 v126.68,14.92
  Bottom 0.254: v183.2,16.51 169.86,16.51 167.32,13.97 156.21,13.97 IC14.7 150.5,15.24 149.22,16.51 128.27,16.51 v126.68,14.92 | IC11.10 76.83,133.99 v80.64,133.99 | v85.09,39.37 86.04,38.42 v88.58,38.42 | v111.12,10.48 v99.69,10.48
!SWSEL
  Top 0.254: PAD8.1 CPU.31
!TAD
  Top 0.254: PAD2.1 IC7.14
!UIF  (via drill 0.61)
  Top 0.254: v72.39,128.59 73.34,127.64 v73.34,121.28 | v118.11,133.99 v118.11,119.38
  Bottom 0.254: IC11.6 72.07,128.59 v72.39,128.59 | v73.34,121.28 75.25,119.38 108.27,119.38 108.58,119.7 113.67,119.7 113.98,119.38 v118.11,119.38 | v118.11,133.99 118.75,134.62 IC16.10
!WAIT  (via drill 0.61)
  Top 0.254: v29.21,68.9 29.21,115.25 v30.16,116.2 | v84.77,117.16 88.9,121.28 v88.9,126.05 | v136.21,128.27 135.89,127.95 135.89,123.83 v137.16,122.56 | v151.13,122.24 157.48,115.89 157.48,102.55 158.12,101.92 v158.12,99.38 | v151.45,97.79 151.13,97.47 151.13,86.36 151.45,86.04 151.45,78.74 150.5,77.79 150.5,60.96 149.54,60.01 v149.54,33.34
  Bottom 0.254: CPU.11 25.72,68.9 v29.21,68.9 | v30.16,116.2 31.11,117.16 v84.77,117.16 | v88.9,126.05 89.22,125.73 95.57,125.73 95.89,126.05 98.42,126.05 98.74,125.73 111.76,125.73 113.98,127.95 120.97,127.95 121.28,127.64 128.59,127.64 129.22,128.27 v136.21,128.27 | v137.16,122.56 138.43,121.28 149.22,121.28 149.86,121.92 150.81,121.92 v151.13,122.24 | v158.12,99.38 156.53,97.79 v151.45,97.79 | v149.54,33.34 149.22,33.02 SV1.26
!WE  (via drill 0.61)
  Top 0.254: IC36.8 178.75,47.31 v178.75,45.4
  Bottom 0.254: v178.75,45.4 179.07,45.72 202.25,45.72 207.01,50.48 207.01,54.61 208.6,54.61 209.55,55.56 209.55,114.3 IC38.27 190.82,114.3 189.55,115.57 176.53,115.57 IC39.27
!XTA
  Top 0.254: IC26.8 175.9,14.61 175.9,58.74 177.8,60.64 IC36.13 | IC35.5 184.15,54.61 184.15,59.69 IC35.2
  Bottom 0.254: IC35.10 IC35.5 | IC36.13 IC35.2
!XTB  (via drill 0.61)
  Top 0.254: IC26.11 176.53,21.59 176.53,44.45 | 176.53,44.45 176.53,52.07 IC36.10 | IC16.13 128.27,142.24 128.27,141.92 129.22,140.97 131.44,140.97 v131.44,120.33 | 176.53,44.45 v176.85,44.45
  Bottom 0.254: v131.44,120.33 131.76,120.02 149.86,120.02 150.5,120.65 204.15,120.65 210.19,114.62 210.19,44.45 v176.85,44.45
BFLD0
  Bottom 0.254: IC28.5 85.09,135.89 102.87,135.89 104.14,134.62 IC24.12
BFLD1
  Bottom 0.254: IC28.4 85.09,138.43 105.41,138.43 IC24.13
BFLD2
  Bottom 0.254: IC28.3 85.09,140.97 103.82,140.97 105.09,139.7 IC24.14
BFLOAD
  Bottom 0.254: IC40.6 39.37,130.81 65.72,130.81 68.26,133.35 80.01,133.35 IC28.7
BMUX0  (via drill 0.61)
  Top 0.254: IC47.14 120.65,16.51 120.65,49.53 | IC46.14 120.65,49.53 | IC48.14 120.65,95.25 v120.65,90.17 120.65,72.07 120.97,71.75 120.97,66.67 120.65,66.36 120.65,49.53 | IC28.12 89.85,133.03 v89.85,91.44
  Bottom 0.254: v89.85,91.44 91.12,90.17 100.97,90.17 101.28,89.85 113.67,89.85 113.98,90.17 v120.65,90.17
BMUX1  (via drill 0.61)
  Top 0.254: IC47.16 123.19,21.59 123.19,54.61 | IC46.16 123.19,54.61 | 123.19,54.61 123.19,100.33 IC48.16 121.92,100.65 119.7,100.65 119.06,101.28 119.06,101.92 119.38,102.23 119.38,120.97 v119.06,121.28 | IC28.13 94.61,133.99 v94.61,121.92
  Bottom 0.254: v94.61,121.92 95.57,120.97 113.67,120.97 113.98,121.28 v119.06,121.28
BMUX2  (via drill 0.61)
  Top 0.254: v124.78,25.72 124.46,26.04 124.46,44.77 v125.73,46.04 | v138.11,46.99 139.06,47.94 v139.06,61.91 | v115.89,106.68 114.62,107.95 111.76,107.95 v111.76,109.22 | IC28.14 90.17,138.43 90.17,135.89 91.76,135.89 93.66,133.99 93.66,109.22 v93.98,108.9 93.03,107.95 93.03,95.89 v95.25,93.66 | v130.49,24.13 131.13,23.5 131.13,21.27 131.44,20.95 131.44,8.26 127,3.81 108.58,3.81 108.58,33.34 v104.14,37.78 | v102.23,38.1 97.16,43.18 97.16,69.22 99.69,71.75 99.69,73.66 97.79,75.56 v97.79,93.66
  Bottom 0.254: IC47.18 122.24,25.72 v124.78,25.72 126.36,24.13 v130.49,24.13 | v125.73,46.04 126.68,46.99 v138.11,46.99 | v139.06,61.91 138.75,62.23 125.09,62.23 123.83,60.96 IC46.18 | v115.89,106.68 IC48.18 | v111.76,109.22 94.3,109.22 v93.98,108.9 | v104.14,37.78 103.82,38.1 v102.23,38.1 | v95.25,93.66 v97.79,93.66
CPSEL  (via drill 0.61)
  Top 0.254: v187.01,135.89 188.28,137.16 188.28,138.43 189.55,139.7 IC23.3
  Bottom 0.254: IC22.5 176.53,135.89 v187.01,135.89
CPUDX0  (via drill 0.61)
  Top 0.254: v40.96,57.15 40.96,87.95 42.86,89.85 42.86,100.33 | 42.86,100.33 42.86,108.27 43.81,109.22 RN4.2 | IC30.15 v78.42,96.84 | v88.9,110.49 87.31,108.9 87.31,106.05 84.14,102.87 81.28,102.87 81.28,96.52 IC19.8 | v42.55,100.33 42.86,100.33
  Bottom 0.254: CPU.16 24.13,54.61 38.42,54.61 v40.96,57.15 | 62.23,100.33 IC33.15 | 62.23,100.33 74.93,100.33 IC30.15 | IC19.8 80.96,96.84 v78.42,96.84 | IC9.2 143.51,110.49 111.76,110.49 111.12,109.86 92.39,109.86 91.76,110.49 v88.9,110.49 | 62.23,100.33 v42.55,100.33
CPUDX1  (via drill 0.61)
  Top 0.254: CPU.17 20.95,52.7 v20.95,92.39 | IC19.7 82.23,98.11 v82.23,98.74 | IC9.3 146.37,105.09 v146.37,104.14 | v126.68,103.82 124.46,101.6 124.46,64.45 125.09,63.82 125.09,49.85 123.83,48.58 123.83,15.56 122.24,13.97 118.43,13.97 118.43,21.91 118.75,22.23 v118.75,60.96 | v116.52,60.64 116.2,60.96 116.2,101.28 114.62,102.87 110.81,102.87 v110.81,97.16 | v49.53,102.87 RN4.3
  Bottom 0.254: v20.95,92.39 35.24,106.68 RN4.3 | 62.23,102.87 IC33.16 | 62.23,102.87 74.93,102.87 IC30.16 79.38,101.6 v82.23,98.74 | v146.37,104.14 145.1,102.87 136.21,102.87 134.94,104.14 131.13,104.14 129.86,102.87 127.64,102.87 v126.68,103.82 | v118.75,60.96 118.43,60.64 v116.52,60.64 | v110.81,97.16 110.49,97.47 102.23,97.47 101.92,97.79 101.28,97.79 98.74,95.25 85.09,95.25 IC19.7 | 62.23,102.87 v49.53,102.87
CPUDX2  (via drill 0.61)
  Top 0.254: v32.07,53.66 32.38,53.98 v32.38,93.66 | v86.36,107.95 85.09,106.68 85.09,105.41 IC19.4
  Bottom 0.254: CPU.18 28.26,53.66 v32.07,53.66 | v32.38,93.66 42.86,104.14 RN4.4 46.99,105.41 54.29,105.41 55.56,104.14 IC33.17 62.23,105.41 72.07,105.41 73.34,104.14 IC30.17 IC19.4 | IC9.4 144.15,104.78 138.11,104.78 137.48,105.41 136.53,105.41 134.94,107 130.81,107 129.86,107.95 113.98,107.95 113.35,107.31 92.39,107.31 91.76,107.95 v86.36,107.95
CPUDX3  (via drill 0.61)
  Top 0.254: v39.05,52.07 44.45,57.47 44.45,62.23 RN1.2 | v66.99,106.68 68.26,105.41 v73.34,105.41 | IC9.9 142.56,93.66 142.56,114.3 v142.88,114.62 | v88.9,114.3 86.68,112.08 86.68,109.54 IC19.3 | v48.58,65.09 49.21,65.72 49.21,83.19 55.56,89.53 v55.56,105.41
  Bottom 0.254: CPU.19 29.21,52.07 v39.05,52.07 | v66.99,106.68 IC33.18 56.83,106.68 v55.56,105.41 | v73.34,105.41 74.61,106.68 IC30.18 IC19.3 | v142.88,114.62 142.56,114.3 133.99,114.3 133.67,114.62 113.98,114.62 113.67,114.3 v88.9,114.3 | RN1.2 47.31,65.09 v48.58,65.09
CPUDX4  (via drill 0.61)
  Top 0.254: v75.25,59.69 74.93,59.37 74.93,44.45 IC27.11 | IC6.9 128.27,44.45 128.27,42.86 128.59,42.55 128.59,38.1 v128.27,37.78 | IC32.11 v106.68,38.1
  Bottom 0.254: CPU.20 24.13,44.45 44.45,44.45 | RN1.10 44.45,44.45 | 59.69,44.45 IC37.11 | 44.45,44.45 59.69,44.45 | 74.93,44.45 IC27.11 | 59.69,44.45 74.93,44.45 | IC32.11 106.05,43.81 100.01,43.81 99.38,44.45 74.93,44.45 | IC5.18 90.17,59.69 v75.25,59.69 | v128.27,37.78 127.95,37.47 108.9,37.47 108.27,38.1 v106.68,38.1
CPUDX5  (via drill 0.61)
  Top 0.254: CPU.21 44.45,43.18 44.45,44.45 RN1.9 | v110.17,49.53 106.68,46.04 IC32.12 | v92.39,49.53 92.71,49.85 92.71,51.12 92.39,51.44 92.39,52.07 92.71,52.39 92.71,57.15 IC5.17 91.44,59.37 93.34,61.28 93.34,77.79 92.39,78.74 92.39,80.01 96.2,83.82 96.2,112.39 v95.89,112.71 | v133.03,133.67 v133.03,137.48 | v110.81,113.35 v110.81,135.89
  Bottom 0.254: 74.93,46.99 62.23,46.99 IC37.12 60.33,45.09 56.83,45.09 54.93,46.99 46.99,46.99 RN1.9 | IC27.12 74.93,46.99 | IC32.12 105.41,46.99 94.93,46.99 | 74.93,46.99 94.93,46.99 | IC6.8 126.05,48.26 124.78,49.53 v110.17,49.53 | 94.93,46.99 v92.39,49.53 | IC41.13 166.37,138.43 133.99,138.43 v133.03,137.48 | v133.03,133.67 132.72,133.35 127.95,133.35 126.36,134.94 123.19,134.94 122.24,135.89 v110.81,135.89 | v110.81,113.35 110.17,112.71 v95.89,112.71
CPUDX6  (via drill 0.61)
  Top 0.254: v110.49,53.34 107.95,50.8 107.95,49.53 IC32.13
  Bottom 0.254: IC6.7 123.51,50.8 122.24,52.07 115.57,52.07 IC46.6 v110.49,53.34 | IC32.13 106.05,48.9 100.01,48.9 99.38,49.53 93.66,49.53 92.39,50.8 IC5.14 90.17,49.53 74.93,49.53 | CPU.22 40.64,48.26 RN1.8 46.99,49.53 58.1,49.53 59.37,48.26 IC37.13 62.23,49.53 74.93,49.53 | IC27.13 74.93,49.53
CPUDX7  (via drill 0.61)
  Top 0.254: IC5.13 93.34,48.26 v93.34,51.75 | v112.08,52.39 v112.08,58.42
  Bottom 0.254: IC6.6 130.81,54.61 130.81,57.15 120.33,57.15 120.02,57.47 115.25,57.47 IC46.4 v112.08,58.42 | CPU.23 40.32,50.48 45.4,50.48 RN1.7 46.99,52.07 57.15,52.07 57.78,51.44 59.37,51.44 60.01,50.8 IC37.14 61.59,51.44 67.63,51.44 68.26,52.07 74.93,52.07 | IC27.14 74.93,52.07 | 74.93,52.07 93.03,52.07 v93.34,51.75 93.66,52.07 100.01,52.07 101.28,50.8 IC32.14 110.49,50.8 v112.08,52.39
CPUDX8  (via drill 0.61)
  Top 0.254: IC5.8 82.55,49.53 82.55,54.29 v82.87,54.61 | v109.54,63.5 107.95,61.91 107.95,54.61 IC32.15 | v119.7,63.18 v119.7,56.52
  Bottom 0.254: CPU.24 38.42,51.12 43.5,51.12 RN1.6 48.9,53.34 50.16,54.61 59.69,54.61 IC37.15 65.72,53.34 66.99,54.61 74.93,54.61 IC27.15 81.6,53.34 v82.87,54.61 105.41,54.61 IC32.15 | v109.54,63.5 IC46.2 119.38,63.5 v119.7,63.18 | IC6.5 129.22,55.56 123.19,55.56 122.24,54.61 121.6,54.61 v119.7,56.52
CPUDX9  (via drill 0.61)
  Top 0.254: IC6.4 128.27,57.15 128.27,54.93 v128.59,54.61 | IC5.7 85.41,52.39 v85.41,55.88
  Bottom 0.254: v128.59,54.61 127.32,53.34 IC46.15 115.89,53.34 114.62,54.61 107.95,54.61 IC32.16 105.41,57.15 84.14,57.15 | CPU.25 40.64,55.88 RN1.5 46.99,57.15 54.61,57.15 55.88,55.88 IC37.16 61.59,56.52 67.63,56.52 68.26,57.15 74.93,57.15 | IC27.16 74.93,57.15 | 84.14,57.15 v85.41,55.88 | 74.93,57.15 84.14,57.15
CPUDX10  (via drill 0.61)
  Top 0.254: v124.78,48.26 125.73,49.21 125.73,59.69 v126.68,60.64 | v119.7,54.29 v119.7,48.58
  Bottom 0.254: v124.78,48.26 IC46.13 121.6,48.58 v119.7,48.58 | v126.68,60.64 127,60.96 IC6.3 | CPU.27 RN1.4 51.75,58.42 53.02,59.69 55.24,59.69 56.52,58.42 IC37.17 61.59,59.05 67.63,59.05 68.26,59.69 73.98,59.69 75.25,58.42 IC27.17 IC5.4 89.85,58.42 91.12,59.69 99.38,59.69 100.01,59.05 106.05,59.05 IC32.17 107.95,57.15 114.62,57.15 114.94,56.83 117.16,56.83 v119.7,54.29
CPUDX11  (via drill 0.61)
  Top 0.254: v132.4,44.45 132.08,44.77 132.08,60.96 IC6.2
  Bottom 0.254: IC46.11 122.24,43.5 128.27,43.5 129.22,44.45 v132.4,44.45 | CPU.28 RN1.3 51.75,60.96 53.02,62.23 62.23,62.23 | 62.23,62.23 IC37.18 | 62.23,62.23 74.93,62.23 IC27.18 IC5.3 88.58,60.96 89.85,62.23 105.41,62.23 IC32.18 109.54,60.96 110.81,62.23 124.14,62.23 124.78,62.87 128.91,62.87 IC6.2
DATAF  (via drill 0.61)
  Top 0.254: CPU.40 38.73,92.08 v38.73,119.7 | v107.63,122.56 109.54,124.46 v109.54,135.89 | v132.72,109.54 132.4,109.86 132.4,119.06 133.67,120.33 v133.67,121.6
  Bottom 0.254: v38.73,119.7 43.18,124.14 69.22,124.14 69.85,123.51 95.57,123.51 96.84,122.24 103.5,122.24 104.14,122.87 107.31,122.87 v107.63,122.56 108.58,121.6 110.17,121.6 110.49,121.92 118.11,121.92 118.43,122.24 119.38,122.24 119.7,121.92 133.35,121.92 v133.67,121.6 | v109.54,135.89 110.81,137.16 IC16.4 | IC21.19 136.84,109.54 v132.72,109.54
DEVINTREQ  (via drill 0.61)
  Top 0.254: IC30.3 66.36,108.9 66.36,127 65.72,127.64 65.72,143.51 72.07,149.86 95.89,149.86 95.89,149.22 99.06,146.05 102.23,146.05 v102.23,137.48 | v120.33,129.54 v120.33,139.38 | v127.32,128.59 127.64,128.27 v127.64,113.67 | v166.37,112.08 169.54,115.25 169.54,122.56 v173.04,126.05
  Bottom 0.254: v102.23,137.48 103.82,135.89 107,135.89 109.54,138.43 116.84,138.43 117.79,139.38 v120.33,139.38 | v120.33,129.54 121.6,128.27 127,128.27 v127.32,128.59 | v127.64,113.67 132.08,113.67 133.03,112.71 136.53,112.71 136.84,113.03 149.86,113.03 150.18,112.71 151.76,112.71 152.08,113.03 160.34,113.03 161.29,112.08 v166.37,112.08 | v173.04,126.05 174.62,127.64 196.22,127.64 IC23.8
DFLD0  (via drill 0.61)
  Top 0.254: v55.56,15.56 56.52,16.51 56.52,45.4 56.2,45.72 v56.2,56.83 57.78,58.42 v57.78,72.71 | v140.02,89.22 140.02,99.38 140.65,100.01 140.65,128.91 140.97,129.22 v140.97,133.35 | v104.46,86.36 v104.46,76.52 | v136.84,86.04 137.16,86.36 IC21.11
  Bottom 0.254: IC42.7 53.66,15.56 v55.56,15.56 | v56.2,56.83 56.52,57.15 67.31,57.15 IC27.4 | IC25.5 135.57,134.62 136.84,133.35 v140.97,133.35 148.59,133.35 IC34.10 | IC21.11 137.48,89.22 v140.02,89.22 | v57.78,72.71 59.37,74.3 101.6,74.3 103.82,76.52 v104.46,76.52 | v104.46,86.36 136.53,86.36 v136.84,86.04
DFLD1  (via drill 0.61)
  Top 0.254: v55.56,23.18 55.24,23.5 55.24,57.78 v56.83,59.37 56.83,82.23 59.69,85.09 v59.69,85.41 | v140.97,94.3 141.92,95.25 141.92,128.27 142.88,129.22 142.88,134.3 144.46,135.89 146.05,135.89 146.05,133.35 IC34.6 | v133.03,85.41 134.94,87.31 v134.94,92.39
  Bottom 0.254: IC42.4 53.66,23.18 v55.56,23.18 | v56.83,59.37 57.15,59.69 67.31,59.69 IC27.3 | IC25.4 130.18,136.53 136.21,136.53 136.84,135.89 149.54,135.89 152.08,133.35 152.72,133.35 154.94,131.13 154.94,128.27 152.08,128.27 148.27,132.08 IC34.6 | v140.97,94.3 137.48,94.3 IC21.13 136.53,93.98 v134.94,92.39 | v59.69,85.41 104.78,85.41 105.09,85.72 132.72,85.72 v133.03,85.41
DFLD2  (via drill 0.61)
  Top 0.254: v69.53,29.21 70.48,30.16 70.48,35.56 69.22,36.83 69.22,42.23 70.48,43.5 70.48,61.59 IC27.2 69.85,64.77 69.85,81.92 v69.53,82.23 | v140.97,99.06 141.29,99.38 141.29,128.59 141.92,129.22 141.92,136.84 IC34.3 | v131.76,84.77 132.08,85.09 132.08,85.72 132.4,86.04 132.4,93.03 132.08,93.34 132.08,96.2 v134.3,98.42
  Bottom 0.254: IC42.3 57.15,29.21 v69.53,29.21 | v140.97,99.06 IC21.15 134.94,99.06 v134.3,98.42 | IC25.3 129.86,140.02 135.89,140.02 136.84,140.97 137.48,140.97 138.75,139.7 IC34.3 | v69.53,82.23 69.85,82.55 77.47,82.55 79.06,84.14 105.41,84.14 105.73,84.45 118.43,84.45 119.06,83.82 128.91,83.82 129.86,84.77 v131.76,84.77
DFLOAD  (via drill 0.61)
  Top 0.254: v70.17,124.46 v66.67,127.95 | v112.71,124.14 113.03,124.46 v113.03,130.49 | v126.68,133.35 129.54,130.49 IC25.7
  Bottom 0.254: IC40.8 47.62,127.64 66.36,127.64 v66.67,127.95 | v70.17,124.46 70.48,124.14 v112.71,124.14 | v113.03,130.49 113.35,130.81 116.2,130.81 118.75,133.35 v126.68,133.35
DMAGNT  (via drill 0.61)
  Top 0.254: v79.06,66.99 80.01,66.04 80.01,39.05 v81.92,37.15 | v107.63,36.51 108.58,37.47 v108.58,44.13 | v119.7,33.34 v119.7,46.99 | v197.17,64.14 v197.17,43.5 | v164.47,70.8 161.29,67.63 161.29,63.18 161.61,62.87 161.61,61.59 v160.66,60.64
  Bottom 0.254: CPU.3 19.05,82.55 19.05,69.85 32.07,69.85 34.92,66.99 37.47,66.99 37.78,67.31 78.74,67.31 v79.06,66.99 | v81.92,37.15 82.55,36.51 99.06,36.51 99.38,36.2 107.31,36.2 v107.63,36.51 | v108.58,44.13 111.44,46.99 v119.7,46.99 | v119.7,33.34 120.65,32.38 130.81,32.38 131.44,31.75 155.89,31.75 157.16,33.02 186.69,33.02 v197.17,43.5 | v197.17,64.14 190.5,70.8 v164.47,70.8 | v160.66,60.64 159.7,59.69 146.05,59.69 SV1.5
DMUX0  (via drill 0.61)
  Top 0.254: IC47.5 115.57,21.59 115.57,54.61 | IC46.5 115.57,54.61 | IC48.5 115.57,100.33 115.57,54.61 | v125.41,135.89 124.78,135.25 v124.78,120.97 | v122.87,120.97 120.02,118.11 v120.02,101.6
  Bottom 0.254: IC25.12 135.89,135.89 v125.41,135.89 | v122.87,120.97 v124.78,120.97 | IC48.5 v120.02,101.6
DMUX1  (via drill 0.61)
  Top 0.254: IC47.7 113.03,16.51 113.03,32.7 113.98,33.66 113.98,41.91 113.03,42.86 113.03,49.53 | IC46.7 113.03,49.53 | IC48.7 113.03,95.25 113.03,90.81 | 113.03,90.81 113.03,83.82 114.3,82.55 114.3,67.63 113.03,66.36 113.03,49.53 | IC25.13 135.25,135.25 v135.25,123.19 | v109.54,123.19 108.9,122.56 108.9,94.93 113.03,90.81
  Bottom 0.254: v135.25,123.19 129.22,123.19 128.91,123.51 117.79,123.51 117.47,123.19 v109.54,123.19
DMUX2  (via drill 0.61)
  Top 0.254: v118.11,10.16 118.11,13.34 117.79,13.65 117.79,22.23 118.11,22.54 118.11,44.45 | v117.16,45.4 118.11,44.45 | 118.11,44.45 118.11,60.33 116.84,61.59 116.84,90.81 v117.16,91.12 117.79,91.76 117.79,112.39 v118.43,113.03 | v127.95,138.43 126.36,136.84 126.36,134.3 125.73,133.67 v125.73,113.67
  Bottom 0.254: v118.11,10.16 IC47.9 | v117.16,45.4 116.84,45.72 IC46.9 | IC48.9 114.62,91.12 v117.16,91.12 | IC25.14 136.53,139.06 130.49,139.06 129.86,138.43 v127.95,138.43 | v125.73,113.67 125.09,113.03 v118.43,113.03
EMA0  (via drill 0.61)
  Top 0.254: v97.79,101.6 98.11,101.92 v98.11,125.09 | v119.06,125.09 120.33,123.83 v120.33,120.97 | v149.54,23.5 153.67,27.62 153.67,39.05 155.89,41.27 v155.89,42.55 | v164.78,43.18 165.42,43.81 165.42,116.52 v165.74,116.84
  Bottom 0.254: v97.79,101.6 IC19.16 | v119.06,125.09 v98.11,125.09 | v120.33,120.97 123.51,117.79 159.07,117.79 IC39.1 v165.74,116.84 171.45,116.84 172.72,118.11 181.61,118.11 IC38.1 | SV1.34 147.96,23.5 v149.54,23.5 | v155.89,42.55 156.53,43.18 v164.78,43.18
EMA1  (via drill 0.61)
  Top 0.254: v97.79,98.74 98.74,97.79 v98.74,78.74 | 127.64,78.11 127.64,53.66 129.22,52.07 130.81,52.07 130.81,41.91 130.49,41.59 130.49,32.38 131.44,31.43 131.44,30.48 v132.4,29.53 | 127.64,78.11 v127.64,79.06 | v141.6,29.21 144.15,26.67 147.32,26.67 SV1.32 | IC39.26 171.13,107.63 v171.13,89.22 | v140.02,84.77 138.11,82.87 136.21,82.87 136.21,83.82 135.57,84.45 132.72,84.45 132.72,83.19 127.64,78.11
  Bottom 0.254: IC39.26 175.9,112.39 181.93,112.39 182.56,113.03 196.85,113.03 IC38.26 | IC19.15 91.76,98.74 v97.79,98.74 | v98.74,78.74 127.32,78.74 v127.64,79.06 | v132.4,29.53 132.72,29.21 v141.6,29.21 | v171.13,89.22 167,85.09 151.13,85.09 150.81,84.77 142.88,84.77 142.56,84.45 140.34,84.45 v140.02,84.77
EMA2  (via drill 0.61)
  Top 0.254: IC19.12 94.3,88.58 v94.3,87.95 | SV1.30 147.32,29.21 144.15,29.21 141.92,31.43 141.92,40.01 143.51,41.59 143.51,46.35 142.88,46.99 142.88,73.03 143.19,73.34 143.19,85.72 v141.92,87 140.97,87 139.06,88.9 139.06,99.38 140.02,100.33 140.02,114.94 v139.7,115.25
  Bottom 0.254: IC38.2 181.61,113.03 161.29,113.03 IC39.2 159.7,114.62 144.15,114.62 143.19,115.57 140.02,115.57 v139.7,115.25 | v94.3,87.95 107.95,87.95 108.27,88.27 113.35,88.27 114.62,87 v141.92,87
ERROR  (via drill 0.61)
  Top 0.254: IC6.19 135.89,64.77 135.89,74.61 136.21,74.93 v136.21,79.06 | v144.78,78.74 147.32,81.28 v147.32,92.71 v147.32,107.95 | IC10.6 57.47,127.95 v57.47,116.2 | v109.86,116.84 109.86,95.25 v112.08,93.03
  Bottom 0.254: v136.21,79.06 136.53,79.38 141.29,79.38 141.92,78.74 v144.78,78.74 | v147.32,107.95 148.59,109.22 IC9.19 | v57.47,116.2 87.31,116.2 87.95,116.84 v109.86,116.84 | v112.08,93.03 112.39,92.71 126.68,92.71 129.22,90.17 129.86,90.17 131.13,91.44 135.57,91.44 136.84,92.71 v147.32,92.71
FLD0  (via drill 0.61)
  Top 0.254: v133.03,93.66 133.99,94.61 v133.99,95.57 | v126.68,94.93 v126.68,102.55
  Bottom 0.254: IC19.17 93.03,102.55 100.65,102.55 RN3.2 102.55,102.55 113.67,102.55 113.98,102.87 126.36,102.87 v126.68,102.55 | 129.86,91.76 131.76,93.66 v133.03,93.66 | v133.99,95.57 136.21,95.57 IC21.14 | 129.86,91.76 v126.68,94.93 | 129.86,91.76 IC21.9
FLD1  (via drill 0.61)
  Top 0.254: v134.94,101.28 135.25,100.97 135.25,96.84 v134.94,96.52
  Bottom 0.254: IC19.14 91.76,96.84 99.38,96.84 RN3.3 102.55,98.11 111.12,98.11 111.44,97.79 122.24,97.79 123.51,96.52 IC21.7 v134.94,96.52 | IC21.16 136.84,101.28 v134.94,101.28
FLD2  (via drill 0.61)
  Top 0.254: v134.62,103.19 137.16,105.73 IC21.18 | v125.41,95.25 125.73,95.57 v125.73,101.28
  Bottom 0.254: IC19.13 92.08,94.61 99.69,94.61 RN3.4 102.87,95.25 v125.41,95.25 | v134.62,103.19 131.13,103.19 IC21.5 126.05,101.6 v125.73,101.28
GND  (via drill 0.61)
  Top 0.254: v112.08,47.94 v112.08,43.5 | IC32.10 IC32.9 IC32.8 97.79,49.53 97.79,57.15 IC32.4 IC32.3 IC32.2 100.33,64.77 100.33,73.98 99.69,74.61 v99.69,88.9 v99.69,92.39 99.69,102.23 RN3.1 99.06,106.68 IC24.8 | IC27.9 IC27.10 | IC37.9 IC37.10 | IC42.18 59.05,27.3 v59.05,40.01 | IC25.1 IC25.2 132.08,142.24 132.08,133.35 v133.03,132.4 | IC25.11 IC25.10 IC25.9 | IC34.13 IC34.14 IC34.15 | IC41.7 IC41.8 | IC34.8 147,129.22 v147,136.84 | IC28.9 IC28.10 IC28.11 | IC24.9 IC24.10 IC24.11 | v32.7,132.4 IC3.12 | IC11.2 67.31,140.97 67.31,130.81 IC11.7 | IC28.1 83.82,143.51 | 83.82,143.51 IC28.2 82.55,140.97 82.55,128.27 IC28.8 IC19.1 | IC24.1 99.06,143.51 | 99.06,143.51 IC24.2 | 99.06,143.51 83.82,143.51 | IC16.7 v114.3,127 | IC7.4 IC7.5 | IC7.8 8.89,125.73 8.89,97.79 IC31.7 6.35,95.25 6.35,59.69 QG2.7 | IC47.10 113.03,8.89 113.03,11.43 IC47.8 | 29.21,19.05 IC2.12 | v29.21,13.97 29.21,19.05 | IC4.8 68.26,12.38 68.26,3.17 67.63,2.54 57.47,2.54 57.47,3.49 IC42.10 | CPU.15 26.67,52.07 26.67,37.15 29.21,34.61 29.21,19.05 | v129.54,37.78 IC6.10 | v136.21,37.15 135.89,36.83 135.89,21.59 IC1.12 v139.7,17.78 | SV1.39 SV1.37 | IC18.7 199.39,13.97 199.39,24.13 IC18.2 199.39,26.67 199.39,46.99 IC20.7 | IC26.7 172.09,14.61 172.09,46.35 IC36.7 | IC9.10 146.37,87.31 v146.37,83.82 | IC21.8 128.27,92.71 128.27,90.17 IC21.10 | IC21.17 135.89,102.87 135.89,94.61 | 135.89,94.61 133.35,92.08 v133.35,89.22 | IC33.2 IC33.3 IC33.4 IC33.5 IC33.6 IC33.7 IC33.8 IC33.9 IC33.10 | IC30.4 IC30.5 IC30.6 IC30.7 IC30.8 IC30.9 IC30.10 | IC19.10 IC5.1 | v137.79,83.82 135.89,85.72 135.89,94.61 | v182.56,54.29 182.88,54.61 IC38.14
  Bottom 0.254: IC46.10 113.98,43.5 v112.08,43.5 | IC46.8 112.39,48.26 v112.08,47.94 111.76,47.62 107.63,47.62 107,46.99 106.36,46.99 105.09,48.26 IC32.8 | 82.55,41.91 IC5.10 | 82.55,41.91 69.85,41.91 IC27.10 65.41,40.01 v59.05,40.01 55.88,43.18 IC37.10 | IC32.10 93.03,43.18 91.76,41.91 82.55,41.91 | IC34.8 IC25.9 IC25.8 v114.3,127 | v133.03,132.4 133.35,132.08 IC25.11 | IC23.7 189.23,130.81 182.56,130.81 181.29,129.54 IC22.7 173.99,128.27 165.74,128.27 164.47,129.54 IC41.7 IC34.13 147.32,137.16 v147,136.84 | IC48.8 106.36,93.98 104.78,92.39 v99.69,92.39 | IC24.10 IC16.7 | IC24.9 IC24.8 IC28.9 IC28.8 70.17,127 68.58,128.59 | 68.58,128.59 66.99,127 46.67,127 44.77,128.91 38.73,128.91 IC40.7 35.56,129.54 v32.7,132.4 | 68.58,128.91 68.58,128.59 | IC10.7 54.61,128.27 65.72,128.27 66.36,128.91 68.58,128.91 | 68.58,128.91 IC11.7 | IC19.18 91.12,107 86.04,107 85.09,107.95 85.09,111.76 IC19.1 | IC7.5 6.35,133.35 6.35,127 IC7.8 | CPU.26 31.43,55.88 | 31.43,55.88 CPU.15 10.16,55.88 QG2.7 | 31.43,55.88 37.78,62.23 41.91,62.23 RN1.1 51.75,66.04 53.02,64.77 82.55,64.77 IC5.1 | IC4.8 69.85,13.97 82.55,13.97 | IC13.8 82.55,13.97 | IC17.7 98.74,14.92 94.61,14.92 | 94.61,14.92 92.71,14.92 91.76,13.97 82.55,13.97 | IC47.8 96.84,12.7 94.61,14.92 | IC12.7 8.89,13.97 v29.21,13.97 36.51,13.97 | 36.51,13.97 36.83,13.97 IC8.7 | IC42.10 50.16,10.79 39.69,10.79 36.51,13.97 | v129.54,37.78 129.86,38.1 135.25,38.1 v136.21,37.15 | SV1.39 146.05,13.97 153.67,13.97 IC14.8 156.21,11.43 168.91,11.43 IC26.7 | SV1.37 v139.7,17.78 | IC18.2 203.2,22.86 IC18.12 | IC15.7 186.69,11.43 199.39,11.43 IC18.7 | IC29.7 156.21,49.53 168.91,49.53 IC36.7 170.81,48.9 176.85,48.9 177.48,49.53 180.66,49.53
  Bottom 0.254: IC20.7 194.63,48.26 193.36,49.53 186.69,49.53 IC35.7 181.93,48.26 180.66,49.53 | IC38.14 181.61,82.55 161.29,82.55 IC39.14 v146.37,83.82 v137.79,83.82 | v133.35,89.22 133.03,88.9 IC21.10 126.36,88.9 125.09,87.63 115.57,87.63 IC48.10 v99.69,88.9 93.03,88.9 91.76,87.63 87.95,87.63 86.68,88.9 IC19.10 82.55,90.17 69.85,90.17 IC30.10 | IC33.6 54.61,97.79 66.99,97.79 68.26,99.06 IC30.6 | 180.66,49.53 180.66,54.29 v182.56,54.29
IFETCH  (via drill 0.61)
  Top 0.254: CPU.36 40.01,83.19 v40.01,119.7 | v59.37,121.28 62.23,124.14 62.23,138.43 61.59,139.06 | IC10.12 61.59,139.06 | IC22.4 169.54,142.88 v169.54,147.64 169.54,148.59 205.42,148.59 210.19,143.83 210.19,10.16 198.12,10.16 IC15.9 | v71.12,150.18 63.18,142.24 63.18,140.65 61.59,139.06
  Bottom 0.254: IC15.4 190.5,15.24 IC15.9 | v40.01,119.7 41.59,121.28 v59.37,121.28 | v169.54,147.64 167.64,149.54 146.69,149.54 145.73,150.5 71.44,150.5 v71.12,150.18
IFLD0  (via drill 0.61)
  Top 0.254: 130.18,99.69 133.67,103.19 133.67,113.35 v133.35,113.67 | 130.18,99.69 IC21.6 | v150.5,113.67 150.18,113.98 150.18,129.86 IC34.11 | v66.36,15.56 67.31,16.51 67.31,49.53 IC27.7 | v64.77,135.89 64.45,135.57 64.45,113.35 64.77,113.03 v64.77,81.6 64.77,54.93 64.45,54.61 v64.45,50.48 | 130.18,99.69 131.44,98.42 131.44,90.49 131.76,90.17 131.76,86.36 130.81,85.41 v130.81,82.55
  Bottom 0.254: v150.5,113.67 v133.35,113.67 | IC42.14 61.28,15.56 v66.36,15.56 | IC24.5 97.79,133.35 82.55,133.35 80.01,135.89 v64.77,135.89 | v64.45,50.48 64.77,50.8 IC27.7 | v130.81,82.55 118.43,82.55 117.79,83.19 106.36,83.19 106.05,82.87 80.33,82.87 78.74,81.28 65.09,81.28 v64.77,81.6
IFLD1  (via drill 0.61)
  Top 0.254: IC42.13 62.87,14.61 62.87,45.4 61.28,46.99 59.69,46.99 59.69,49.21 60.01,49.53 60.01,50.16 59.69,50.48 59.69,51.75 v60.01,52.07 | v134.62,106.05 135.25,106.68 135.25,119.38 136.21,120.33 | 136.21,120.33 138.11,122.24 v138.11,124.14 | v142.88,124.14 143.51,124.78 143.51,133.35 IC34.5 | IC24.4 97.16,135.25 v97.16,123.19 96.84,122.87 96.84,79.06 v96.2,78.42 | 136.21,120.33 v134.94,121.6 | IC27.6 67.31,54.61 v67.31,76.52
  Bottom 0.254: v60.01,52.07 67.31,52.07 IC27.6 | IC21.4 131.44,106.05 v134.62,106.05 | v142.88,124.14 v138.11,124.14 | v97.16,123.19 97.47,123.51 107.95,123.51 109.22,122.24 109.86,122.24 110.17,122.56 117.79,122.56 118.11,122.87 128.59,122.87 128.91,122.56 133.99,122.56 v134.94,121.6 | v67.31,76.52 67.63,76.83 81.28,76.83 81.6,76.52 83.82,76.52 85.72,78.42 v96.2,78.42
IFLD2  (via drill 0.61)
  Top 0.254: v64.45,13.97 65.41,14.92 65.41,49.53 | v65.41,54.29 65.41,49.53 | v120.33,141.92 120.65,142.24 120.65,142.56 121.6,143.51 128.27,143.51 128.27,145.1 129.22,146.05 133.67,146.05 v133.67,145.73 133.67,138.11 133.99,137.79 133.99,125.09 132.4,123.51 132.4,120.02 130.81,118.43 130.81,110.49 IC21.2 | v141.29,145.73 IC34.2 | 65.41,49.53 63.5,49.53 63.5,60.01 64.14,60.64 64.14,80.96 63.82,81.28 v63.82,93.66 | v93.98,97.79 94.93,98.74 94.93,120.97 95.57,121.6 95.57,124.46 95.25,124.78 95.25,135.89 IC24.3